# EAGLE schematic Un_GPS (EAGLE 6.2)
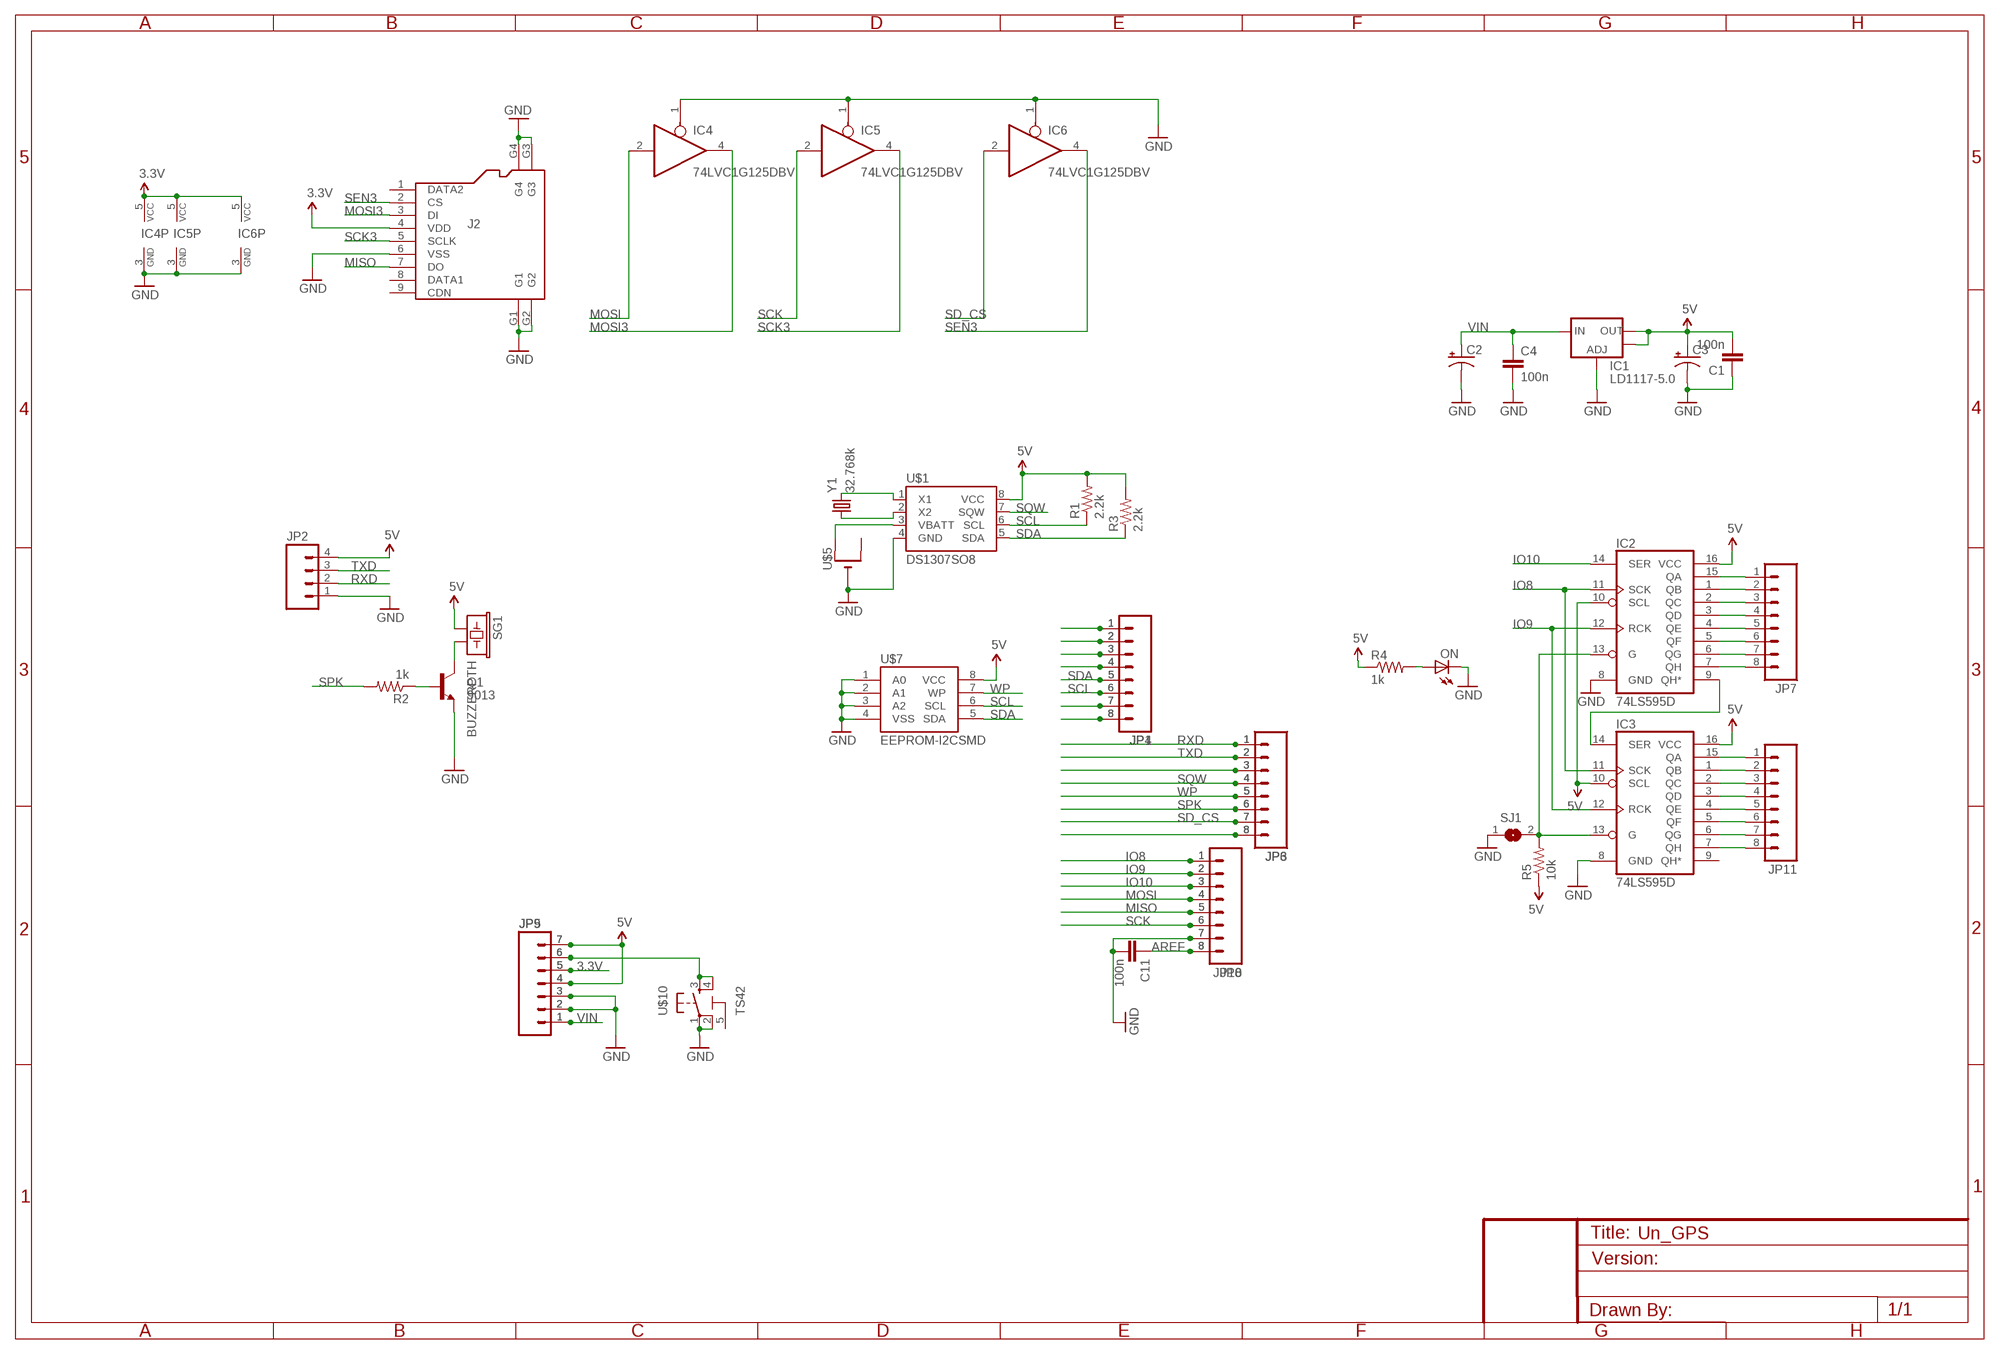
[diagram p0: schematic, sheet 1]

## Parts
C1  100n  CAP0603-CAP  [0603-CAP]
C2  CAP_POL1206  [EIA3216]
C3  CAP_POL1206  [EIA3216]
C4  100n  CAP0603-CAP  [0603-CAP]
C11  100n  CAP0603-CAP  [0603-CAP]
IC1  LD1117-5.0  V_REG_LM1117SOT223  [SOT223]
IC2  74LS595D  [SO16]
IC3  74LS595D  [SO16]
IC4  74LVC1G125DBV  [SOT23-5]
IC5  74LVC1G125DBV  [SOT23-5]
IC6  74LVC1G125DBV  [SOT23-5]
J2  HOLDER-MICROSD-9P  [9P-SMD-W/-RING]
JP1  M081X08  [1X08]
JP2  M04PTH  [1X04]
JP3  M08  [1X08]
JP4  M081X08  [1X08]
JP5  M07  [1X07]
JP6  M08  [1X08]
JP7  M081X08  [1X08]
JP8  M08  [1X08]
JP9  M07  [1X07]
JP10  M08  [1X08]
JP11  M081X08  [1X08]
ON  LED0805  [LED-0805]
Q1  9013  TRANSISTOR_NPNSOT23-3  [SOT23-3]
R1  2.2k  RESISTOR0805-RES  [0805]
R2  1k  RESISTOR0805-RES  [0805]
R3  2.2k  RESISTOR0805-RES  [0805]
R4  1k  RESISTOR0805-RES  [0805]
R5  10k  RESISTOR0805-RES  [0805]
SG1  BUZZERPTH  [BUZZER-12MM]
SJ1  SJ  [SJ]
U$1  DS1307SO8  [SO08]
U$5  CR1220THM  [CR1220-THM]
U$7  EEPROM-I2CSMD  [SO08]
U$10  TS42  [TS42]
Y1  32.768k  CRYSTALTC26H  [TC26H]

## Nets
3.3V: IC4.5(VCC) IC5.5(VCC) IC6.5(VCC) J2.4(VDD) JP5.5 JP9.5
5V: C1.2 C3.A(+) IC1.2(OUT) IC1.4(OUT) IC2.10(SCL) IC2.16(VCC) IC3.10(SCL) IC3.16(VCC) JP2.4 JP5.4 JP5.7 JP9.4 JP9.7 R1.2 R3.2 R4.1 R5.1 SG1.+ U$1.8(VCC) U$7.8(VCC)
A0: JP1.1 JP4.1
AREF: C11.1 JP8.8 JP10.8
GND: C1.1 C2.C(-) C3.C(-) C4.2 C11.2 IC1.1(ADJ) IC2.8(GND) IC3.8(GND) IC4.1(OE) IC4.3(GND) IC5.1(OE) IC5.3(GND) IC6.1(OE) IC6.3(GND) J2.6(VSS) J2.G1 J2.G2 J2.G3 J2.G4 JP2.1 JP5.2 JP5.3 JP8.7 JP9.2 JP9.3 JP10.7 ON.2(C) Q1.2(E) SJ1.1 U$1.4(GND) U$5.- U$7.1(A0) U$7.2(A1) U$7.3(A2) U$7.4(VSS) U$10.1 U$10.2
IO8: IC2.11(SCK) IC3.11(SCK) JP8.1 JP10.1
IO9: IC2.12(RCK) IC3.12(RCK) JP8.2 JP10.2
IO10: IC2.14(SER) JP8.3 JP10.3
MISO: J2.7(DO) JP8.5 JP10.5
MOSI: IC4.2(I) JP8.4 JP10.4
MOSI3: IC4.4(O) J2.3(DI)
N$1: U$1.1(X1) Y1.2
N$2: U$1.2(X2) Y1.1
N$3: U$1.3(VBATT) U$5.+1(+)
N$4: Q1.3(C) SG1.-
N$5: Q1.1(B) R2.1
N$6: IC2.9(QH*) IC3.14(SER)
N$7: IC2.13(G) IC3.13(G) R5.2 SJ1.2
N$10: IC2.15(QA) JP7.1
N$11: IC2.1(QB) JP7.2
N$12: JP1.7 JP4.7
N$13: JP1.8 JP4.8
N$14: IC2.2(QC) JP7.3
N$15: IC2.3(QD) JP7.4
N$19: IC2.4(QE) JP7.5
N$20: IC2.5(QF) JP7.6
N$21: IC2.6(QG) JP7.7
N$22: IC2.7(QH) JP7.8
N$23: IC3.15(QA) JP11.1
N$24: JP3.3 JP6.3
N$29: JP3.8 JP6.8
N$30: IC3.1(QB) JP11.2
N$31: JP1.2 JP4.2
N$32: JP1.3 JP4.3
N$33: JP1.4 JP4.4
N$34: ON.1(A) R4.2
N$35: IC3.2(QC) JP11.3
N$36: IC3.3(QD) JP11.4
N$37: IC3.4(QE) JP11.5
N$38: JP5.6 JP9.6 U$10.3 U$10.4
N$39: IC3.5(QF) JP11.6
N$40: IC3.6(QG) JP11.7
N$41: IC3.7(QH) JP11.8
RXD: JP2.2 JP3.1 JP6.1
SCK: IC5.2(I) JP8.6 JP10.6
SCK3: IC5.4(O) J2.5(SCLK)
SCL: JP1.6 JP4.6 R1.1 U$1.6(SCL) U$7.6(SCL)
SD_CS: IC6.2(I) JP3.7 JP6.7
SDA: JP1.5 JP4.5 R3.1 U$1.5(SDA) U$7.5(SDA)
SEN3: IC6.4(O) J2.2(CS)
SPK: JP3.6 JP6.6 R2.2
SQW: JP3.4 JP6.4 U$1.7(SQW)
TXD: JP2.3 JP3.2 JP6.2
VIN: C2.A(+) C4.1 IC1.3(IN) JP5.1 JP9.1
WP: JP3.5 JP6.5 U$7.7(WP)
Unconnected: IC3.9(QH*) J2.1(DATA2) J2.8(DATA1) J2.9(CDN) U$5.+2(+1) U$10.5

## Library data of the parts
C1 C4 C11 = 1SparkFun:CAP: Capacitor Standard 0603 ceramic capacitor, and 0.1" leaded capacitor.
C2 C3 = 1SparkFun:CAP_POL: Capacitor Polarized These are standard SMD and PTH capacitors. Normally 10uF, 47uF, and 100uF in electrolytic and tantalum varieties. Always verify the external diameter of the through hole cap, it varies with capacity, voltage, and manufacturer. The EIA devices should be standard.
IC1 = 1SparkFun:V_REG_LM1117: Voltage Regulator LM1117 Standard adjustable voltage regulator but in SMD form. Spark Fun Electronics SKU : COM-00595
IC2 IC3 = 2SparkFun:74*595: 8-bit SHIFT REGISTER, output latch
IC4-IC6 = 74xx-little-us:74*1G125: Single Bus Buffer Gate with 3-State Output
J2 = SeeedStudio-Connector:HOLDER-MICROSD-9P
JP1 JP4 JP7 JP11 = 2SparkFun:M08: Header 8 Standard 8-pin 0.1" header. Use with straight break away headers (SKU : PRT-00116), right angle break away headers (PRT-00553), swiss pins (PRT-00743), machine pins (PRT-00117), and female headers (PRT-00115).
JP2 = 2SparkFun:M04: Header 4 Standard 4-pin 0.1" header. Use with straight break away headers (SKU : PRT-00116), right angle break away headers (PRT-00553), swiss pins (PRT-00743), machine pins (PRT-00117), and female headers (PRT-00115). Molex polarized connector foot print use with SKU : PRT-08231 with associated crimp pins and housings. 1MM SMD Version SKU: PRT-10208
JP3 JP6 JP8 JP10 = 1SparkFun:M08: Header 8 Standard 8-pin 0.1" header. Use with straight break away headers (SKU : PRT-00116), right angle break away headers (PRT-00553), swiss pins (PRT-00743), machine pins (PRT-00117), and female headers (PRT-00115).
JP5 JP9 = 2SparkFun:M07: Header 7 Standard 7-pin 0.1" header. Use with straight break away headers (SKU : PRT-00116), right angle break away headers (PRT-00553), swiss pins (PRT-00743), machine pins (PRT-00117), and female headers (PRT-00115). NOTES ON THE VARIANTS LOCK and LOCK_LONGPADS... This footprint was designed to help hold the alignment of a through-hole component (i.e. 7-pin header) while soldering it into place. You may notice that each hole has been shifted either up or down by 0.005 of an inch from it's more standard position (which is usually a perfectly straight line). This slight alteration caused the pins (the squares in the middle) to touch the edges of the holes. Because they are alternating, it causes a "brace" to hold the header in place. 0.005 has proven to be the perfect amount of "off-center" position when using our standard breakaway headers. Although looks a little odd when you look at the bare footprint, once you have a header in there, the alteration is very hard to notice. Also, if you push a header all the way into place, it is covered up entirely on the bottom side. This idea of altering the position of holes to aid alignment will be further integrated into the Sparkfun Library for other footprints. It can help hold any component with 3 or more connection pins.
ON = 1SparkFun:LED: LEDs Standard schematic elements and footprints for 5mm, 3mm, 1206, and 0603 sized LEDs. 5mm - Spark Fun Electronics SKU : COM-00529 (and others)
Q1 = 2SparkFun:TRANSISTOR_NPN: Transistor NPN BJT configuration in SOT23 package. MMBT2222 is the common NPN we use. Double check BCE configuration again layout.
R1-R5 = 2SparkFun:RESISTOR: Resistor Basic schematic elements and footprints for 0603, 1206, and PTH resistors.
SG1 = 2SparkFun:BUZZER: Buzzer 12mm Spark Fun Electronics SKU : Comp-Buzzer
SJ1 = jumper:SJ: SMD solder JUMPER
U$1 = 2SparkFun:DS1307
U$5 = 1adafruit:CR1220: CR1216/CR1220/CR1225 12mm 3V lithium coin cell Great for battery packup. Both SMT and THM holders. Note the THM package has the ground pads on both sides of the PCB so that the masks are the same - this reduces the cost
U$7 = 2SparkFun:EEPROM-I2C
U$10 = 2SparkFun:TS42
Y1 = 2SparkFun:CRYSTAL: Crystals Various standard crystals. Proven footprints. Spark Fun Electronics SKU : COM-00534

## Net classes
0 default: width 0.254 mm, clearance 0.254 mm
1 power: width 0.61 mm, drill 0.61 mm, clearance 0.254 mm
2 gnd: width 0.305 mm, drill 0.559 mm, clearance 0.254 mm
3 usbvcc: width 0.508 mm, drill 0.61 mm, clearance 0.254 mm
4 aref: width 0.406 mm, drill 0.61 mm, clearance 0.254 mm